# Altium schematic sheet FPGA.SchDoc
size Tabloid; SheetNumber: 5; SheetTotal: 8; Sheet_Name: FPGA; Size: 11x17
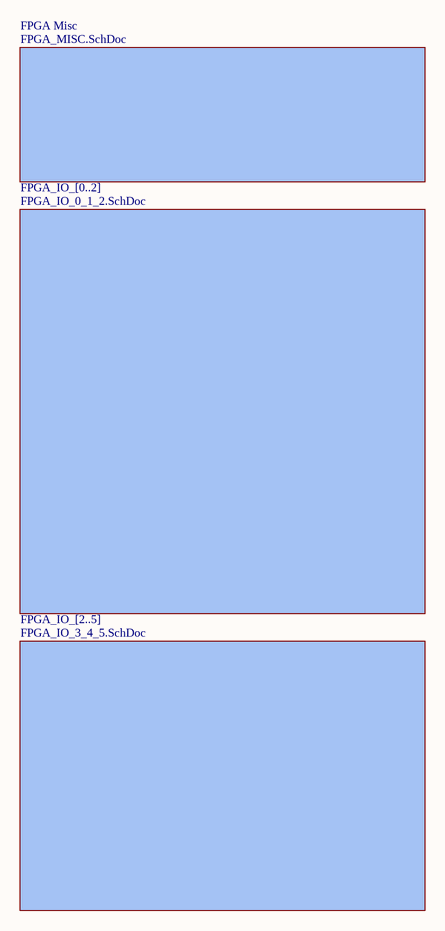
[diagram p0: FPGA.SchDoc]

## Sub-sheets
FPGA Misc = FPGA_MISC.SchDoc: no entries
FPGA_IO_[0..2] = FPGA_IO_0_1_2.SchDoc: no entries
FPGA_IO_[2..5] = FPGA_IO_3_4_5.SchDoc: no entries

## Notes on the sheet
- Sheet Name
- Project Title
- Global Project
- Size
- Group
- Revision
- Date
- Sheet
- of
- Filename
- Designers